# Altium project ScanQR_ESP32.PrjPcb
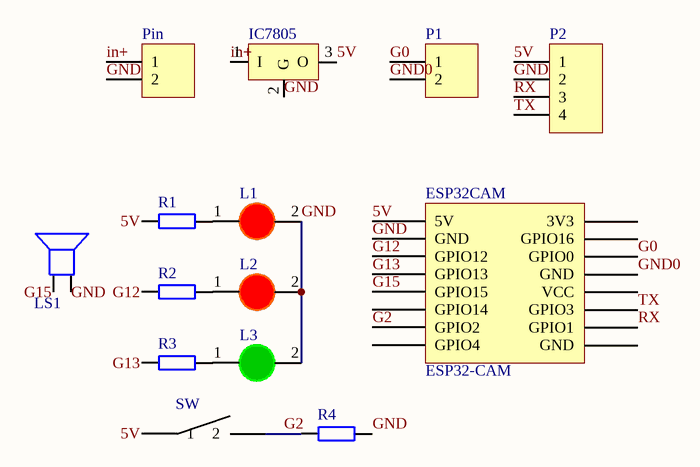
[diagram p0: ScanQR_ESP32_sch.SchDoc]
1 sheet, 14 parts. Net scope: global (net labels, ports and power ports of the same name join across sheets).
Board file: ScanQR_ESP32_pcb.PcbDoc

## Sheet ScanQR_ESP32_sch.SchDoc
size A; SheetNumber: 1; SheetTotal: 1

### Parts
ESP32CAM  ESP32-CAM  [ESP32-CAM]
IC7805  LM78xx  [TO220-123]  (value not drawn)
L1  LED 5mm  [LED-5MM-RED]  (value not drawn)
L2  LED 5mm  [LED-5MM-RED]  (value not drawn)
L3  LED 5mm  [LED-5MM-Green]  (value not drawn)
LS1  Coi Chip Speaker  [Coi Chip Speacker]  (value not drawn)
P1  Header 2x1  [HDR1X2]  (value not drawn)
P2  Header 4P  [HDR1X4]  (value not drawn)
Pin  Header 2x1  [HDR1X2]  (value not drawn)
R1  0.11R  [tro vach 1/4w]  (value not drawn)
R2  0.11R  [tro vach 1/4w]  (value not drawn)
R3  0.11R  [tro vach 1/4w]  (value not drawn)
R4  0.11R  [tro vach 1/4w]  (value not drawn)
SW  Switch 2pins 6x6x5  [Switch 2pins 6x6x5]  (value not drawn)

### Nets
5V: ESP32CAM.1(5V) IC7805.3(O) P2.1 R1.1 SW.1
G0: ESP32CAM.14(GPIO0) P1.1
G2: ESP32CAM.7(GPIO2) R4.1 SW.2
G12: ESP32CAM.3(GPIO12) R2.1
G13: ESP32CAM.4(GPIO13) R3.1
G15: ESP32CAM.5(GPIO15) LS1.1
GND: ESP32CAM.2(GND) IC7805.2(G) L1.2(K) L2.2(K) L3.2(K) LS1.2 P2.2 Pin.2 R4.2
GND0: ESP32CAM.13(GND) P1.2
in+: IC7805.1(I) Pin.1
RX: ESP32CAM.10(GPIO1) P2.3
TX: ESP32CAM.11(GPIO3) P2.4
NetL1_1: L1.1(A) R1.2
NetL2_1: L2.1(A) R2.2
NetL3_1: L3.1(A) R3.2

Not connected (* = marked no-connect by the designer): ESP32CAM 6(GPIO14) 8(GPIO4) 9(GND) 12(VCC) 15(GPIO16) 16(3V3)

### Library data of the parts
IC7805 = LM78xx: Positive Voltage Regulator; Note: Tab is connected to pin 3 (GND).; Published: 24-Aug-2001; LatestRevisionDate: 17-Jul-2002; LatestRevisionNote: Re-released for DXP Platform.; DatasheetVersion: Apr-1994; PackageVersion: Jul-1998; PackageReference: ISOWATT220AB; Publisher: Altium Limited; PackageDescription: TO, Thru-Hole, Vertical, Heatsink Mounted; 3 In-Line Leads; Pitch 2.54 mm; Pin sequence 1, 3, 2; ComponentLink1Description: Manufacturer Link; ComponentLink1URL: http://www.st.com/; ComponentLink2Description: Datasheet; ComponentLink2URL: http://www.st.com/stonline/products/literature/ds/2146/l78m05c.pdf
L1 L2 = LED 5mm Do: Cắm; Don_Vi: Con; Ma_Hang: MH008967; Ten_Linh_Kien: Led 5MM Phủ Đỏ (1000c); Ghi_Chu: *; Kieu_Chan: *; Chung_Loai: Cắm
L3 = LED 5mm Xanh La: Cắm; Don_Vi: Con; Ma_Hang: MH008969; Ten_Linh_Kien: LED 5MM Phủ Xanh (1000c); Ghi_Chu: *; Kieu_Chan: *; Chung_Loai: Cắm
LS1 = Coi Chip Speaker: Còi chip
P1 Pin = Header 2x1: Header, 2-Pin, pitch 2.54mm; Solder: WAVE
P2 = Header 4x1: Header, 4 Pin Pitch 2.54mm; MPN: S1012EC-40-ND; CompanyID: VT-00125; Solder: WAVE; Value: Header 4P
R1-R4 = Tro Vach 1/4W 5% 0.11R: Cắm; Don_Vi: Con; So_Chan: 2; Ten_Linh_Kien: Trở Vạch 1/4w 5% 0.11R; Ma_Hang: MH005220; Chung_Loai: Cắm; Kieu_Chan: *